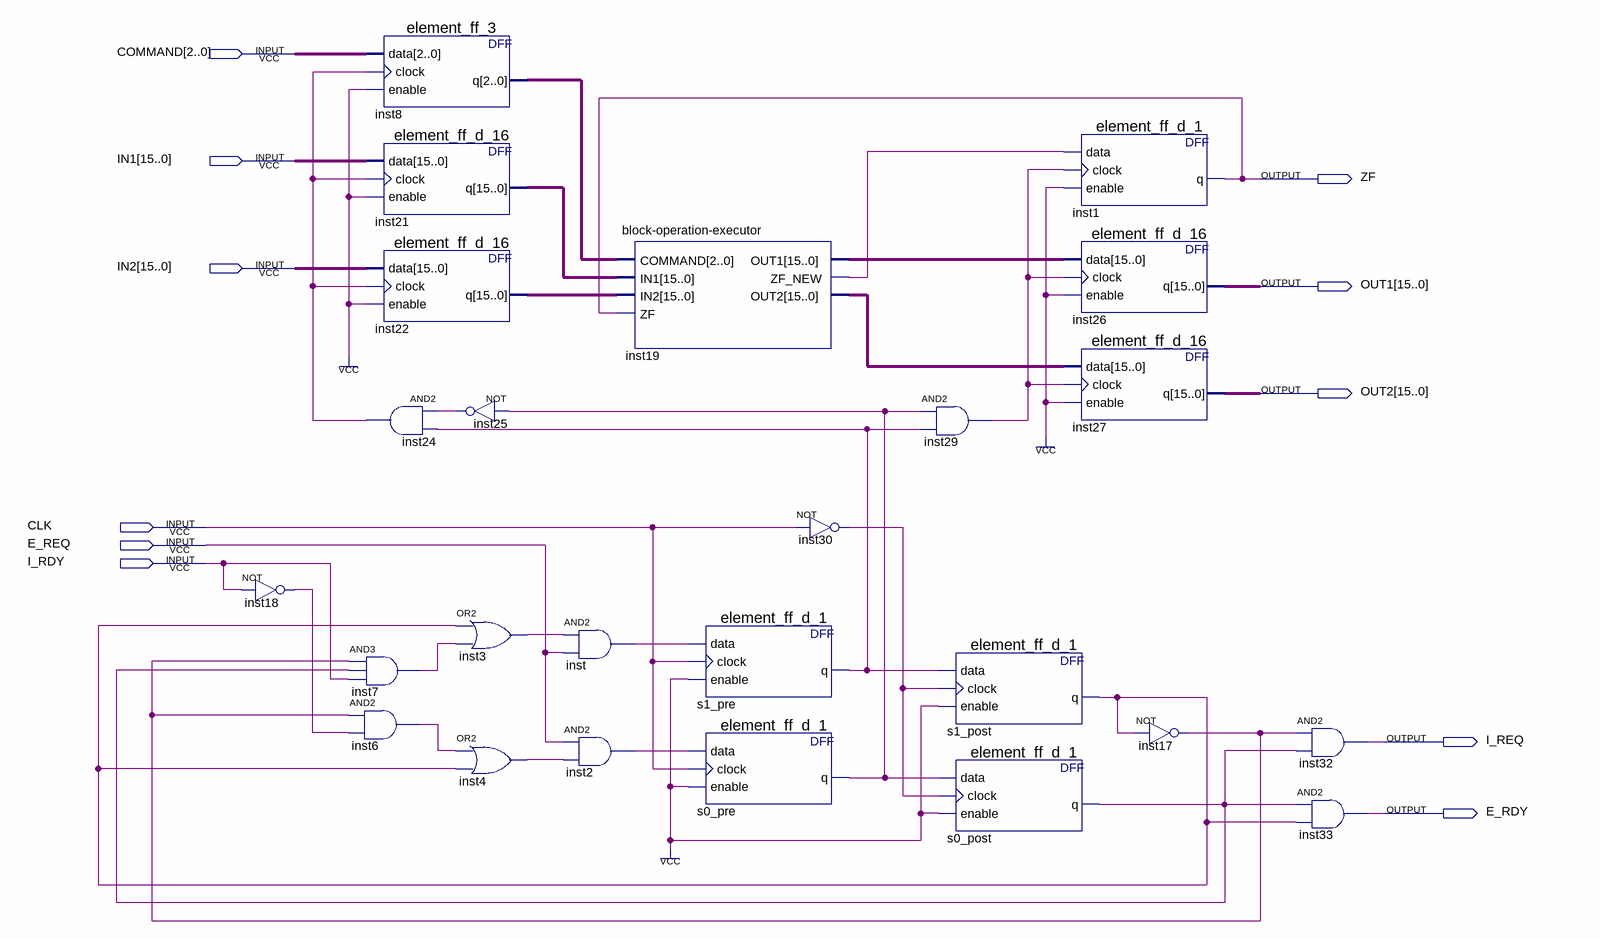
[diagram p0: schematic sheet]
// Quartus schematic block-stage-execution.bdf as structural Verilog: 25 symbols, 11 pins
module \block-stage-execution  (
  input  [2:0] COMMAND,
  input  [15:0] IN1,
  input  [15:0] IN2,
  input  CLK,
  input  E_REQ,
  input  I_RDY,
  output ZF,
  output [15:0] OUT1,
  output [15:0] OUT2,
  output I_REQ,
  output E_RDY
);

  wire inst2_out, inst3_out, inst4_out, inst6_out, inst7_out, inst17_out, inst18_out, inst19_zf_new,
       inst24_out, inst25_out, inst29_out, inst30_out, inst_out, s0_post_q, s0_pre_q, s1_post_q, s1_pre_q;
  wire [2:0] inst8_q;
  wire [15:0] inst19_out1, inst19_out2, inst21_q, inst22_q;

  not inst18 (inst18_out, I_RDY);
  element_ff_3 inst8 (.data(COMMAND), .clock(inst24_out), .enable(1'b1), .q(inst8_q));
  element_ff_d_16 inst21 (.data(IN1), .clock(inst24_out), .enable(1'b1), .q(inst21_q));
  element_ff_d_16 inst22 (.data(IN2), .clock(inst24_out), .enable(1'b1), .q(inst22_q));
  and inst24 (inst24_out, inst25_out, s1_pre_q);
  and inst7 (inst7_out, inst17_out, s0_post_q, I_RDY);
  and inst6 (inst6_out, inst17_out, inst18_out);
  not inst25 (inst25_out, s0_pre_q);
  or inst3 (inst3_out, s1_post_q, inst7_out);
  or inst4 (inst4_out, inst6_out, s1_post_q);
  and inst (inst_out, inst3_out, E_REQ);
  and inst2 (inst2_out, E_REQ, inst4_out);
  \block-operation-executor  inst19 (
    .COMMAND(inst8_q), .IN1(inst21_q), .IN2(inst22_q), .ZF(ZF), .OUT1(inst19_out1), .ZF_NEW(inst19_zf_new),
    .OUT2(inst19_out2));
  element_ff_d_1 s1_pre (.data(inst_out), .clock(CLK), .enable(1'b1), .q(s1_pre_q));
  element_ff_d_1 s0_pre (.data(inst2_out), .clock(CLK), .enable(1'b1), .q(s0_pre_q));
  not inst30 (inst30_out, CLK);
  and inst29 (inst29_out, s0_pre_q, s1_pre_q);
  element_ff_d_1 s1_post (.data(s1_pre_q), .clock(inst30_out), .enable(1'b1), .q(s1_post_q));
  element_ff_d_1 s0_post (.data(s0_pre_q), .clock(inst30_out), .enable(1'b1), .q(s0_post_q));
  element_ff_d_1 inst1 (.data(inst19_zf_new), .clock(inst29_out), .enable(1'b1), .q(ZF));
  element_ff_d_16 inst26 (.data(inst19_out1), .clock(inst29_out), .enable(1'b1), .q(OUT1));
  element_ff_d_16 inst27 (.data(inst19_out2), .clock(inst29_out), .enable(1'b1), .q(OUT2));
  not inst17 (inst17_out, s1_post_q);
  and inst32 (I_REQ, inst17_out, s0_post_q);
  and inst33 (E_RDY, s0_post_q, s1_post_q);
endmodule
